# Altium schematic sheet Oscillator_11.059200MHz.SchDoc
size 81 x 45 mm
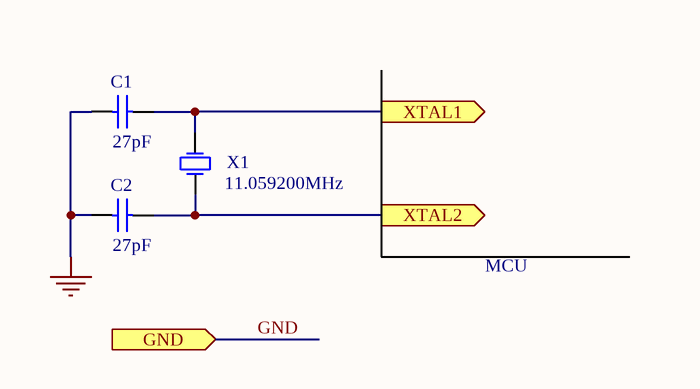
[diagram p0: Oscillator_11.059200MHz.SchDoc]

## Parts
C1  value 27pF  [CAPNTO2.54-3.56x2.03]  (hidden comment: Cap)
C2  value 27pF  [CAPNTO2.54-3.56x2.03]  (hidden comment: Cap)
X1  value 11.059200MHz  [XTAL_1]  (hidden comment: XTAL)

## Ports
GND (in), XTAL1 (out), XTAL2 (out)

## Nets
GND: C1.1 C2.1 ; port GND
XTAL1: C1.2 X1.2(OSC2) ; port XTAL1
XTAL2: C2.2 X1.1(OSC1) ; port XTAL2

## Notes on the sheet
- MCU

## Library data of the parts
C1 C2 = Cap: Capacitor; Manufacturer: Generic Components; Class I: Passive; Published: 8-Jun-2000; Revision: July-2002: Re-released for DXP Platform.; Publisher: Altium Limited; Class II: Capacitor
X1 = XTAL: Crystal Oscillator; Manufacturer: Generic Components; Published: 8-Jun-2000; Revision: July-2002: Re-released for DXP Platform.; Publisher: Altium Limited; Class I: Oscillator; Class II: Crystal Oscillator